# EAGLE design PentaBlinkyCR2032 (EAGLE 7.5.0)
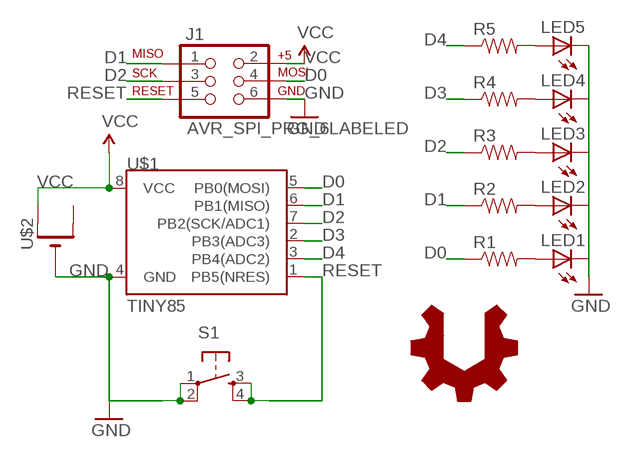
[diagram p0: schematic, sheet 1]

## Parts
J1  AVR_SPI_PRG_6LABELED  [2X3-NS]
LED1  LED5MM  [LED5MM]
LED2  LED5MM  [LED5MM]
LED3  LED5MM  [LED5MM]
LED4  LED5MM  [LED5MM]
LED5  LED5MM  [LED5MM]
R1  RESISTORAXIAL-0.3  [AXIAL-0.3]
R2  RESISTORAXIAL-0.3  [AXIAL-0.3]
R3  RESISTORAXIAL-0.3  [AXIAL-0.3]
R4  RESISTORAXIAL-0.3  [AXIAL-0.3]
R5  RESISTORAXIAL-0.3  [AXIAL-0.3]
S1  TAC_SWITCHPTH  [TACTILE-PTH]
U$1  TINY85  ATTINY13DIP  [DIP08]
U$2  CR2032THM  [CR2032-THRU]
U$3  USER_HACKABLE  [USER_HACKABLE]

## Nets
D0: J1.4(MOSI) R1.P$1 U$1.5(PB0(MOSI))
D1: J1.1(MISO) R2.P$1 U$1.6(PB1(MISO))
D2: J1.3(SCK) R3.P$1 U$1.7(PB2(SCK/ADC1))
D3: R4.P$1 U$1.2(PB3(ADC3))
D4: R5.P$1 U$1.3(PB4(ADC2))
GND: J1.6(GND) LED1.K(C) LED2.K(C) LED3.K(C) LED4.K(C) LED5.K(C) S1.1 S1.2 U$1.4(GND) U$2.-
N$1: LED1.A R1.P$2
N$2: LED2.A R2.P$2
N$3: LED3.A R3.P$2
N$4: LED4.A R4.P$2
N$5: LED5.A R5.P$2
RESET: J1.5(RST) S1.3 S1.4 U$1.1(PB5(NRES))
VCC: J1.2(V+) U$1.8(VCC) U$2.+1(+)
Unconnected: U$2.+2(+1)

## Library data of the parts
J1 = barbary_enterprises:AVR_SPI_PRG_6: AVR ISP 6 Pin This is the reduced ISP connector for AVR programming. Common on Arduino. This footprint will take up less PCB space and can be used with a 10-pin to 6-pin adapter such as SKU: BOB-08508
LED1-LED5 = SparkFun-LED:LED: LEDs Standard schematic elements and footprints for 5mm, 3mm, 1206, and 0603 sized LEDs. 5mm - Spark Fun Electronics SKU : COM-00529 (and others)
R1-R5 = SparkFun-Resistors:RESISTOR: Resistor Basic schematic elements and footprints for 0603, 1206, and PTH resistors.
S1 = barbary_enterprises:TAC_SWITCH: Momentary Switch Button commonly used for reset or general input. Spark Fun Electronics SKU : COM-00097 SMT- SWCH-08247
U$1 = SparkFun-DigitalIC:ATTINY13: Atmel 8-pin 1kB flash uC
U$2 = battery:CR2032
U$3 = logo:USER_HACKABLE

## Board
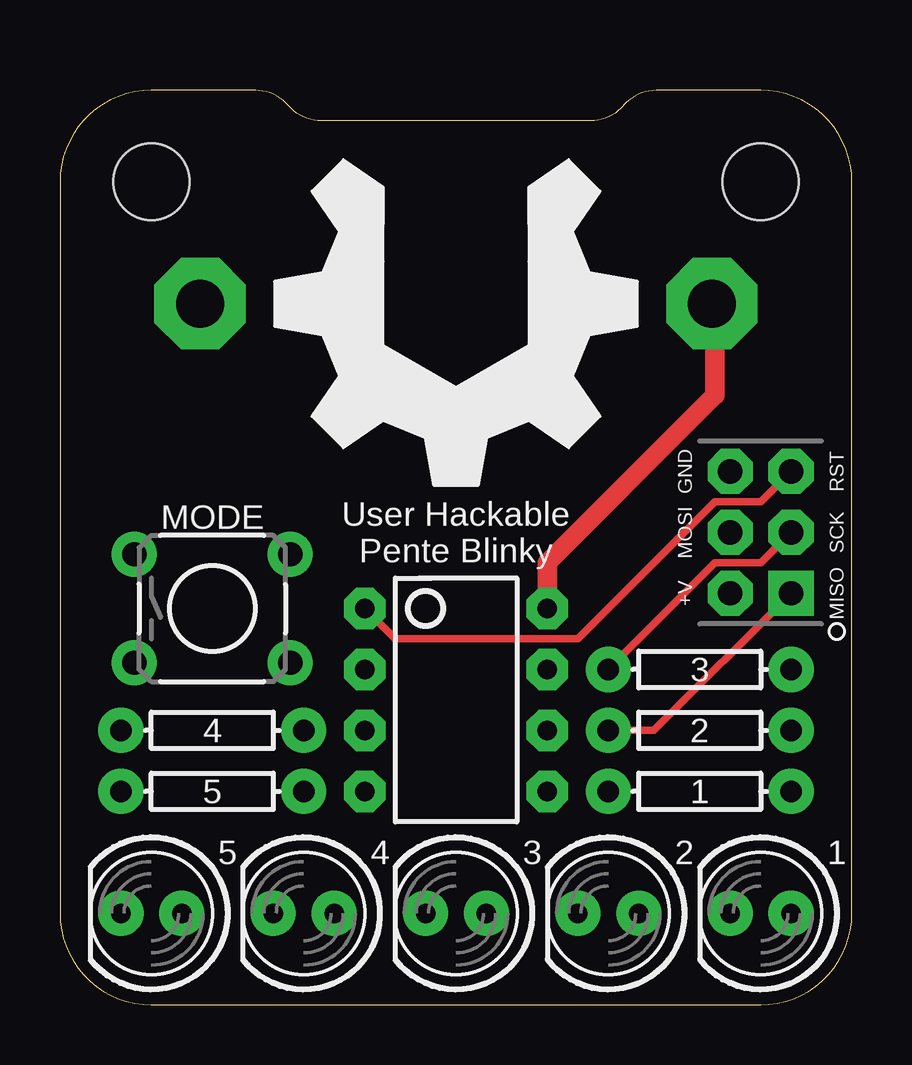
[diagram p1: board, top side]
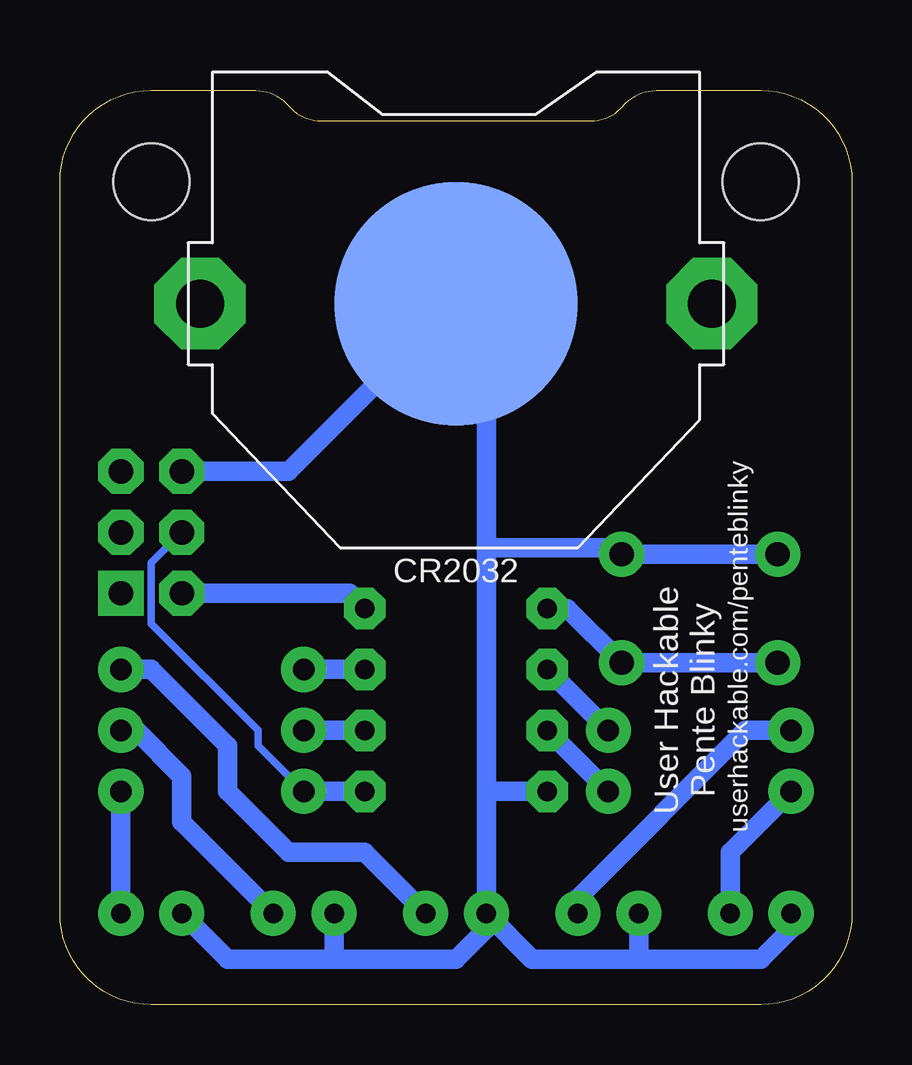
[diagram p2: board, bottom side, seen from below]

Size 33.02 x 38.1 mm. Coordinates in mm from the lower left corner, seen from the top.
Outline: 33.02,3.81 33.02,34.29 arc90 29.21,38.1 24.87,38.1 arc45 23.6,37.57 23.39,37.36 arc-45 22.12,36.83 10.9,36.83 arc-45 9.63,37.36 9.42,37.57 arc45 8.15,38.1 3.81,38.1 arc90 0,34.29 0,3.81 arc90 3.81,0 29.21,0 arc90 33.02,3.81
Copper layers (1*16): Top 0.035mm / dielectric 1.5mm / Bottom 0.035mm
Design rules "default": minimum track width 10mil, minimum drill 24mil, track to track 8mil, track to pad 8mil, pad to pad 8mil, via to via 8mil, smd to smd 8mil, copper to edge 40mil, drill to drill 8mil, minimum pad ring 10mil, minimum via ring 8mil, stop-mask expansion 4mil, vias tented up to drill 0mil, thermal gap 10mil
Holes 3.17 mm at 3.81,34.29 29.21,34.29

### Footprints (pad centres in the part's own frame; a part is rotated, then mirrored left to right if it is on the bottom)
2X3-NS = drill 1.016 pad 1.88 square: 1 -2.54,-1.27 | drill 1.016 pad 1.88 octagon: 2 -2.54,1.27; 3 0,-1.27; 4 0,1.27; 5 2.54,-1.27; 6 2.54,1.27
LED5MM = drill 0.813 pad 1.88: A -1.27,0; K 1.27,0
AXIAL-0.3 = drill 0.9 pad 1.88: P$1 -3.81,0; P$2 3.81,0
TACTILE-PTH = drill 1.016 pad 1.88: 1 -3.251,2.261; 2 3.251,2.261; 3 -3.251,-2.261; 4 3.251,-2.261
DIP08 = drill 0.813 pad 1.727 octagon: 1 -3.81,-3.81; 2 -1.27,-3.81; 3 1.27,-3.81; 4 3.81,-3.81; 5 3.81,3.81; 6 1.27,3.81; 7 -1.27,3.81; 8 -3.81,3.81
CR2032-THRU = drill 2 pad 3.81 octagon: +1 -10.668,0; +2 10.668,0 | smd 10.16 x 10.16: - 0,0

### Placement (x,y rotation side)
J1  29.21,19.68 90 top
LED1  29.21,3.81 180 top
LED2  22.86,3.81 180 top
LED3  16.51,3.81 180 top
LED4  10.16,3.81 180 top
LED5  3.81,3.81 180 top
R1  26.67,8.89 0 top
R2  26.67,11.43 0 top
R3  26.67,13.97 0 top
R4  6.35,11.43 180 top
R5  6.35,8.89 180 top
S1  6.35,16.51 0 top
U$1  16.51,12.7 270 top
U$2  16.51,29.21 0 bottom
U$3  16.51,29.21 0 top

### Tracks (layer width: path | path; a pad name or v marks a point on that pad's centre or on a via)
D0
  Bottom 0.305: J1.4 29.21,18.41 29.21,15.88 24.77,11.43 24.77,10.79 R1.P$1
  Bottom 0.813: U$1.5 R1.P$1
D1
  Top 0.305: J1.1 24.77,11.43 R2.P$1
  Bottom 0.813: U$1.6 R2.P$1
D2
  Top 0.305: J1.3 29.21,18.41 27.3,18.41 R3.P$1
  Bottom 0.813: U$1.7 R3.P$1
D3
  Bottom 0.813: R4.P$1 U$1.2
D4
  Bottom 0.813: R5.P$1 U$1.3
GND
  Bottom 0.813: J1.6 23.5,22.23 U$2.- 15.24,27.94 15.24,19.05 | 15.24,19.05 10.16,19.05 S1.2 S1.1 | 15.24,19.05 15.24,8.89 | 15.24,8.89 LED3.K | LED5.K 2.54,3.17 3.81,1.91 8.89,1.91 | 8.89,1.91 13.34,1.91 LED3.K | LED1.K 26.04,1.91 21.59,1.91 | 21.59,1.91 16.51,1.91 15.24,3.17 LED3.K | LED4.K 8.89,1.91 | LED2.K 21.59,1.91 | U$1.4 15.24,8.89
N$1
  Bottom 0.813: LED1.A R1.P$2
N$2
  Bottom 0.813: LED2.A 27.94,7.62 27.94,9.53 29.84,11.43 R2.P$2
N$3
  Bottom 0.813: LED3.A 20.32,6.35 23.5,6.35 26.04,8.89 26.04,10.79 29.21,13.97 R3.P$2
N$4
  Bottom 0.813: LED4.A 11.43,4.45 4.45,11.43 R4.P$2
N$5
  Bottom 0.813: LED5.A 5.08,6.35 R5.P$2
RESET
  Top 0.305: J1.5 29.21,20.95 27.3,20.95 21.59,15.24 13.97,15.24 U$1.1
  Bottom 0.813: S1.3 S1.4 11.86,16.51 U$1.1
VCC
  Top 0.813: U$2.+1 27.3,29.21 27.3,25.4 20.32,18.41 U$1.8
  Bottom 0.813: J1.2 20.95,17.14 U$1.8

### Text on the board
tPlace: MODE | User Hackable / Pente Blinky | 3 | 4 | 2 | 5 | 1 | 5 | 4 | 3 | 2 | 1
bPlace: CR2032 | userhackable.com/penteblinky | User Hackable / Pente Blinky